# EAGLE design PCB_CoLAB_Schematic_V2 (EAGLE 9.6.2)
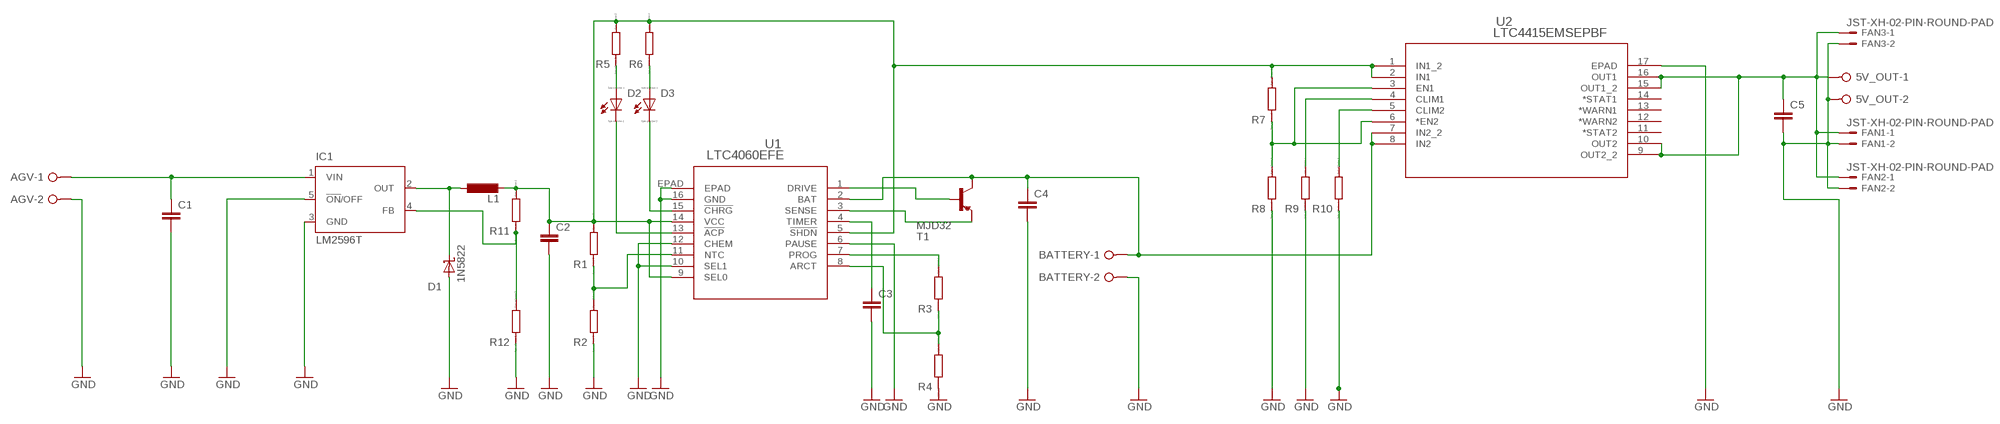
[diagram p0: schematic, sheet 1]

## Parts
5V_OUT  W237-02P  [W237-132]
AGV  W237-02P  [W237-132]
BATTERY  W237-02P  [W237-132]
C1  C-EU050-075X075  [C050-075X075]
C2  C-EU025-050X050  [C025-050X050]
C3  C-EU025-024X044  [C025-024X044]
C4  C-EU050-050X075  [C050-050X075]
C5  C-EU025-024X044  [C025-024X044]
D1  1N5822  [DIOAD2120W130L950D530P]
D2  LED_ELD260  [LED_LD260]
D3  LED_ELD260  [LED_LD260]
FAN1  JST-XH-02-PIN-ROUND-PAD  [JST-XH-02-PACKAGE-ROUND-PAD]
FAN2  JST-XH-02-PIN-ROUND-PAD  [JST-XH-02-PACKAGE-ROUND-PAD]
FAN3  JST-XH-02-PIN-ROUND-PAD  [JST-XH-02-PACKAGE-ROUND-PAD]
IC1  LM2596T  [T05D]
L1  L-EU0204/7  [0204/7]
R1  R0204/7  [0204/7]
R2  R0204/7  [0204/7]
R3  R0204/7  [0204/7]
R4  R0204/7  [0204/7]
R5  R0204/7  [0204/7]
R6  R0204/7  [0204/7]
R7  R0204/7  [0204/7]
R8  R0204/7  [0204/7]
R9  R0204/7  [0204/7]
R10  R0204/7  [0204/7]
R11  R0204/7  [0204/7]
R12  R0204/7  [0204/7]
T1  MJD32  [DPAK]
U1  LTC4060EFE  [TSSOP-16_FE/BC_LIT]
U2  LTC4415EMSEPBF  [MSOP-16_MSE]

## Nets
GND: 5V_OUT.2 AGV.2 BATTERY.2 C1.2 C2.2 C3.2 C4.2 C5.2 D1.A FAN1.2 FAN2.2 FAN3.2 IC1.3(GND) IC1.5(!ON!/OFF) R2.1 R4.1 R8.1 R9.1 R10.1 R12.1 U1.6(PAUSE) U1.10(SEL1) U1.12(CHEM) U1.16(GND) U1.EPAD U2.17(EPAD)
N$1: R3.2 U1.7(PROG)
N$2: AGV.1 C1.1 IC1.1(VIN)
N$3: D1.C IC1.2(OUT) L1.1
N$4: R1.1 R2.2 U1.11(NTC)
N$5: R7.1 R8.2 U2.3(EN1) U2.6(*EN2)
N$6: R3.1 R4.2 U1.8(ARCT)
N$7: T1.3(E) U1.3(SENSE)
N$8: T1.1(B) U1.1(DRIVE)
N$10: C2.1 L1.2 R1.2 R5.2 R6.2 R7.2 R11.2 U1.5(!SHDN) U1.9(SEL0) U1.14(VCC) U2.1(IN1_2) U2.2(IN1)
N$11: C3.1 U1.4(TIMER)
N$12: D2.A R5.1
N$13: D2.K(C) U1.13(!ACP)
N$14: D3.K(C) U1.15(!CHRG)
N$15: D3.A R6.1
N$16: BATTERY.1 C4.1 T1.4(C) U1.2(BAT) U2.7(IN2_2) U2.8(IN2)
N$17: R9.2 U2.4(CLIM1)
N$18: R10.2 U2.5(CLIM2)
N$19: 5V_OUT.1 C5.1 FAN1.1 FAN2.1 FAN3.1 U2.9(OUT2_2) U2.10(OUT2) U2.15(OUT1_2) U2.16(OUT1)
N$20: IC1.4(FB) R11.1 R12.2
Unconnected: U2.11(*STAT2) U2.12(*WARN2) U2.13(*WARN1) U2.14(*STAT1)

## Library data of the parts
5V_OUT AGV BATTERY = con-wago-508:W237-02P: WAGO SREW CLAMP; OC_FARNELL: unknown; OC_NEWARK: unknown
C1-C5 = rcl:C-EU: CAPACITOR, European symbol
D1 = 1N5822:1N5822: 1N5822 Series 40 V 3 A Through Hole Schottky Rectifier - DO-201AD Check prices <https://pricing.snapeda.com/parts/1N5822/ON%20Semiconductor/view-part?ref=eda>; AVAILABILITY: Good; DESCRIPTION: Diode Schottky 40V 3A Through Hole DO-201AD; MF: ON Semiconductor; MP: 1N5822; PACKAGE: AXIAL LEAD-2 ON Semiconductor; PRICE: None; PURCHASE-URL: https://pricing.snapeda.com/search/part/1N5822/?ref=eda
D2 D3 = eagle-ltspice:LED_E: LED Source: http://www.osram.convergy.de Source: www.luxeon.com Source: www.kingbright.com; SPICEMODEL: NONE; SPICEPREFIX: D; SPICETYPE: diode
FAN1-FAN3 = Rembrandt Electronics - JST XH Connectors v1-0:JST-XH-02-PIN: JST XH Connector 2 Pin Wire to board connector. Pitch: 2,54 mm, (0.100") Number of pins: 2 Created by Rembrandt Electronics www.rembrandtelectronics.com
IC1 = national-semiconductor:LM2596: SIMPLE SWITCHER® Power Converter 150 kHz 3A Step-Down Voltage Regulator Source: http://www.national.com/ds/LM/LM2596.pdf; MPN: LM2596T-ADJ/LF02; OC_FARNELL: 9494162; OC_NEWARK: 65K5910
L1 = rcl:L-EU: INDUCTOR, European symbol
R1-R12 = eagle-ltspice:R: RESISTOR, European symbol; SPICEMODEL: NONE; SPICEPREFIX: R
T1 = transistor:MJD32*: Complementary Power Transistors
U1 = LTC4060:LTC4060EFE; BUILT_BY: EMA_UL_Team; MANUFACTURER_PART_NUMBER: LTC4060EFE; SOURCELIBRARY: LinearTech_2016-05-13_9; VENDOR: Linear Technology
U2 = LTC4415EMSEPBF:LTC4415EMSEPBF: Check prices <https://pricing.snapeda.com/parts/LTC4415EMSE%23PBF/Analog%20Devices/view-part?ref=eda>; AVAILABILITY: Warning; DESCRIPTION: OR Controller Source Selector Switch P-Channel 2:2 16-MSOP-EP; MF: Analog Devices; MP: LTC4415EMSE#PBF; PACKAGE: MSOP -16 Analog Devices; PRICE: None; PURCHASE-URL: https://pricing.snapeda.com/search/part/LTC4415EMSE#PBF/?ref=eda

## Board
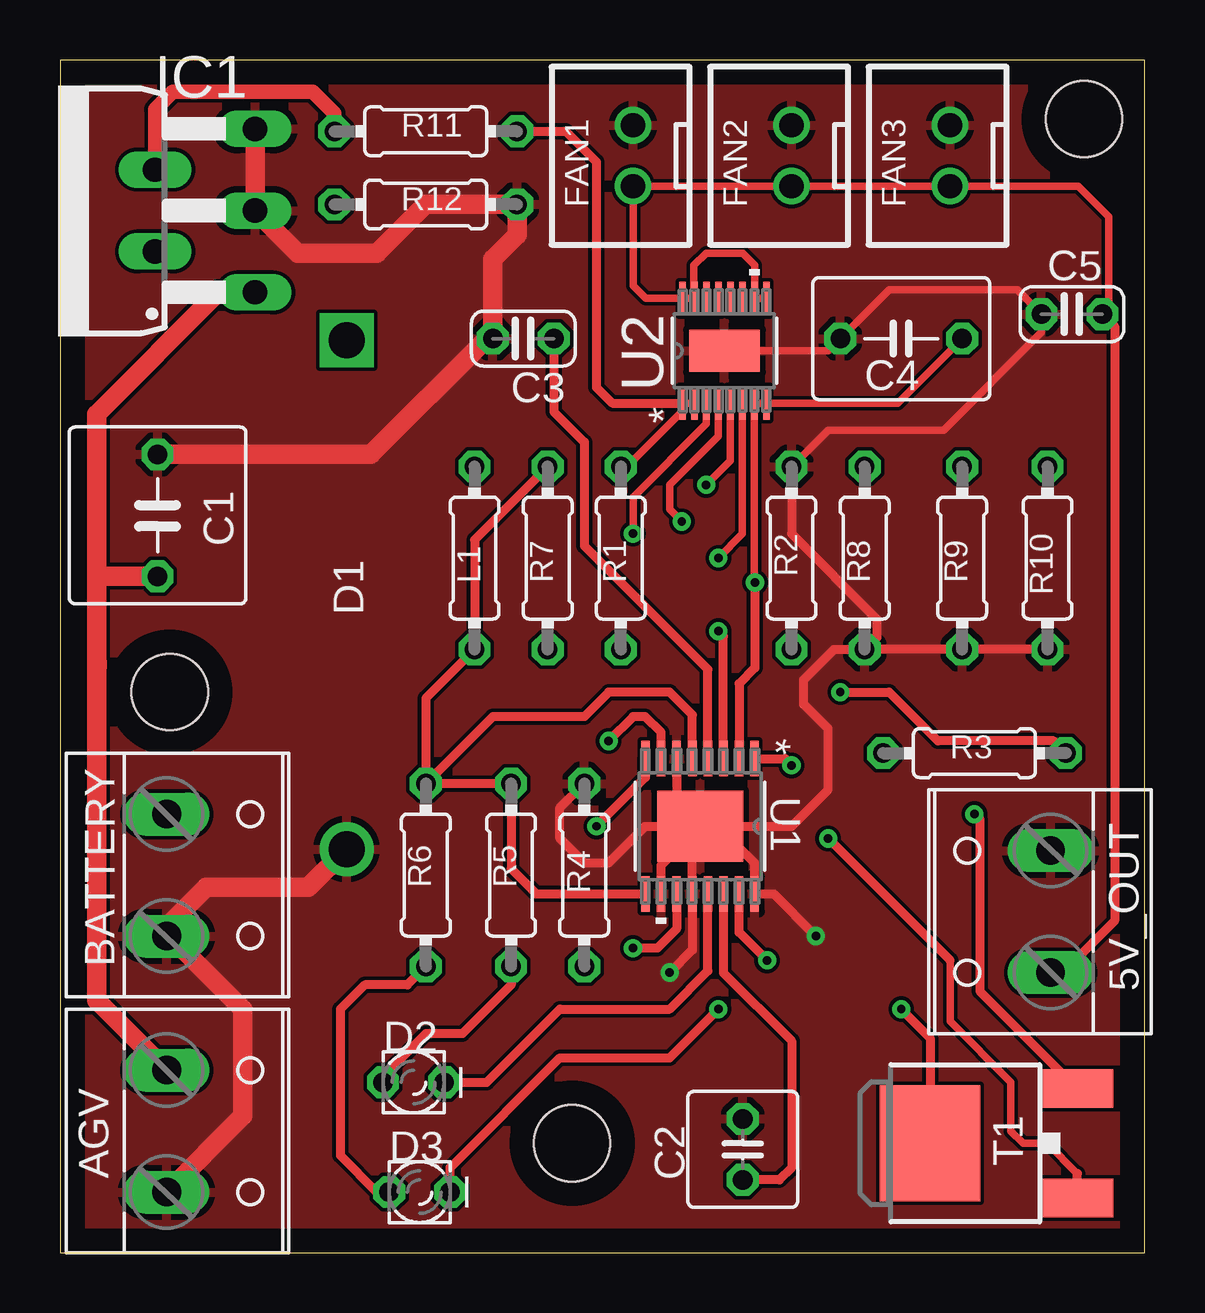
[diagram p1: board, top side]
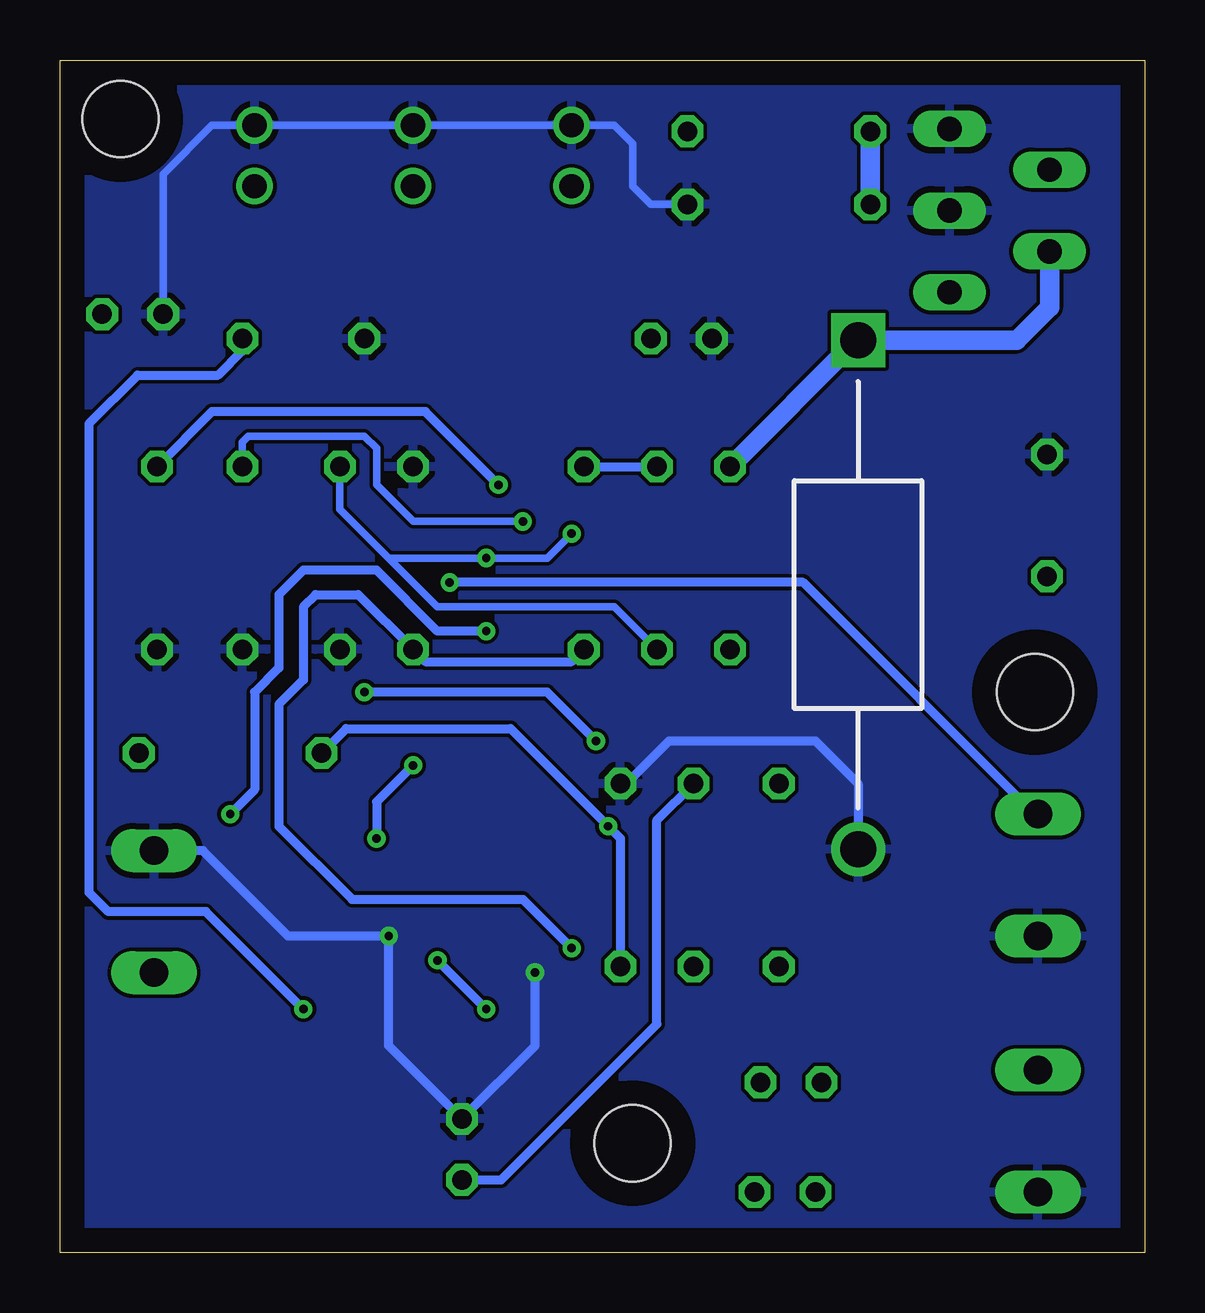
[diagram p2: board, bottom side, seen from below]

Size 45.19 x 49.71 mm. Coordinates in mm from the lower left corner, seen from the top.
Outline: 0,0 45.19,0 45.19,49.71 0,49.71 0,0
Copper layers (1*16): Top 0.035mm / dielectric 1.5mm / Bottom 0.035mm
Design rules "default": minimum track width 6mil, minimum drill 0.35mm, track to track 6mil, track to pad 6mil, pad to pad 6mil, via to via 6mil, smd to smd 6mil, copper to edge 40mil, drill to drill 6mil, minimum pad ring 10mil, minimum via ring 8mil, stop-mask expansion 4mil, vias tented up to drill 0mil, thermal gap 10mil
Holes 3.17 mm at 4.57,23.37 42.67,47.24 21.34,4.57

### Footprints (pad centres in the part's own frame; a part is rotated, then mirrored left to right if it is on the bottom)
W237-132 = drill 1.194 long: 1 -2.54,-0.635; 2 2.54,-0.635
C050-075X075 = drill 0.813 octagon: 1 -2.54,0; 2 2.54,0
C025-050X050 = drill 0.813 octagon: 1 -1.27,0; 2 1.27,0
C025-024X044 = drill 0.813 octagon: 1 -1.27,0; 2 1.27,0
C050-050X075 = drill 0.813 octagon: 1 -2.54,0; 2 2.54,0
DIOAD2120W130L950D530P = drill 1.5 pad 2.25: A 10.6,0 | drill 1.5 pad 2.25 square: C -10.6,0
LED_LD260 = drill 0.813 octagon: A -1.27,0; K 1.27,0
JST-XH-02-PACKAGE-ROUND-PAD = drill 1.016: 1 -1.27,0; 2 1.27,0
T05D = drill 1.016 long: 1 -3.404,-5.08; 2 -1.702,-0.914; 3 0,-5.08; 4 1.702,-0.914; 5 3.404,-5.08
0204/7 = drill 0.813 octagon: 1 -3.81,0; 2 3.81,0
DPAK = smd 1.6 x 3: 1 -2.28,-4.04; 3 2.28,-4.04 | smd 4.826 x 4.191: 4 0,2.096
TSSOP-16_FE/BC_LIT = smd 1.473 x 0.356: 1 -2.819,2.276; 2 -2.819,1.626; 3 -2.819,0.975; 4 -2.819,0.325; 5 -2.819,-0.325; 6 -2.819,-0.975; 7 -2.819,-1.626; 8 -2.819,-2.276; 9 2.819,-2.276; 10 2.819,-1.626; 11 2.819,-0.975; 12 2.819,-0.325; 13 2.819,0.325; 14 2.819,0.975; 15 2.819,1.626; 16 2.819,2.276 | smd 2.946 x 3.581: EPAD 0,0
MSOP-16_MSE = smd 1.397 x 0.279: 1 -2.184,1.751; 2 -2.184,1.251; 3 -2.184,0.751; 4 -2.184,0.25; 5 -2.184,-0.25; 6 -2.184,-0.751; 7 -2.184,-1.251; 8 -2.184,-1.751; 9 2.184,-1.751; 10 2.184,-1.251; 11 2.184,-0.751; 12 2.184,-0.25; 13 2.184,0.25; 14 2.184,0.751; 15 2.184,1.251; 16 2.184,1.751 | smd 1.753 x 2.946: 17 0,0

### Placement (x,y rotation side)
5V_OUT  40.64,14.22 90 top
AGV  5.08,5.08 270 top
BATTERY  5.08,15.75 270 top
C1  4.06,30.73 90 top
C2  28.45,4.32 90 top
C3  19.3,38.1 180 top
C4  35.05,38.1 180 top
C5  42.16,39.12 180 top
D1  11.94,27.43 270 bottom
D2  14.73,7.11 0 top
D3  14.99,2.54 0 top
FAN1  23.88,45.72 90 top
FAN2  30.48,45.72 90 top
FAN3  37.08,45.72 90 top
IC1  3.05,43.43 90 top
L1  17.27,28.96 270 top
R1  23.37,28.96 90 top
R2  30.48,28.96 270 top
R3  38.1,20.83 0 top
R4  21.84,15.75 270 top
R5  18.8,15.75 90 top
R6  15.24,15.75 90 top
R7  20.32,28.96 90 top
R8  33.53,28.96 90 top
R9  37.59,28.96 90 top
R10  41.15,28.96 90 top
R11  15.24,46.74 0 top
R12  15.24,43.69 180 top
T1  38.35,4.57 90 top
U1  26.67,17.78 270 top
U2  27.69,37.59 90 top

### Tracks (layer width: path | path; a pad name or v marks a point on that pad's centre or on a via)
GND  (via drill 0.35)
  Top 0.305: R2.1 32,34.29 36.83,34.29 40.89,38.35 C5.2 39.88,40.13 34.54,40.13 C4.2 32,37.59 U2.17
  Top 0.381: v25.4,11.68 26.34,12.63 U1.12 26.34,17.45 U1.EPAD | v31.5,13.21 29.74,14.96 U1.16 28.95,16.25 27.41,17.78 U1.EPAD | R8.1 32.26,25.15 30.99,23.88 30.99,22.86 32,21.84 32,19.3 30.48,17.78 U1.EPAD | R10.1 R9.1 R8.1 | R2.1 30.48,29.97 34.04,26.42 34.04,25.65 R8.1 | U1.EPAD 26.16,17.27 | R4.1 20.83,18.54 20.83,17.27 21.84,16.26 22.86,16.26 24.38,17.78 U1.EPAD | U1.10 25.04,16.15 U1.EPAD | U1.6 25.7,18.76 U1.EPAD
  Top 0.813: IC1.3 8.38,43.69 | IC1.5 IC1.3 | AGV.2 7.62,5.71 7.62,10.16 4.57,13.21 | 4.57,13.21 BATTERY.2 | D1.A 10.35,15.24 6.1,15.24 4.57,13.72 4.57,13.21 | IC1.3 9.91,41.66 13.21,41.66 15.24,43.69 R12.1 19.05,42.42 18.03,41.4 C3.2 17.78,38.1 12.95,33.27 C1.2
  Bottom 0.305: C5.2 40.89,44.96 38.86,46.99 FAN3.2 FAN2.2 FAN1.2 22.1,46.99 21.34,46.23 21.34,44.45 20.57,43.69 R12.1
  Bottom 0.381: R4.1 21.59,19.56 19.81,21.34 13.72,21.34 11.94,19.56 D1.A | v25.4,11.68 25.4,8.64 C2.2 31.5,8.64 v31.5,13.21 35.69,13.21 39.24,16.76 5V_OUT.2
  pour Bottom: -0.51,50.29 46.23,50.29 46.23,-1.02 -0.51,-1.02
  pour Top: -1.02,50.29 45.72,50.29 46.23,50.8 46.23,-0.51 45.72,-1.02 -1.52,-1.02 -1.02,-0.51
N$1  (via drill 0.35)
  Top 0.381: U1.7 25.04,21.69 24.38,22.35 23.88,22.35 v22.86,21.34 | v32.51,23.37 34.54,23.37 36.58,21.34 41.4,21.34 R3.2
  Bottom 0.381: v22.86,21.34 24.89,23.37 v32.51,23.37
N$2
  Top 0.813: 1.56,24.62 1.56,24.42 1.52,24.38 | 1.52,24.38 1.52,10.54 AGV.1 | 1.52,24.38 1.52,28.45 | 1.52,28.45 1.52,34.95 6.6,40.03 IC1.1 | C1.1 1.78,28.19 1.52,28.45
N$3
  Bottom 0.813: IC1.2 3.96,39.4 5.33,38.03 D1.C 12.01,38.03 L1.1
N$4  (via drill 0.35)
  Top 0.381: U1.11 25.7,13.5 24.89,12.7 v23.88,12.7
  Bottom 0.381: v23.88,12.7 25.91,14.73 33.02,14.73 36.07,17.78 36.07,22.86 35.05,23.88 35.05,26.92 34.54,27.43 32.77,27.43 R2.2 29.97,24.64 23.88,24.64 R1.1
N$5  (via drill 0.35)
  Top 0.305: U2.6 28.44,29.96 v27.43,28.96 | U2.3 26.93,34.55 23.88,31.5 v23.88,29.97
  Bottom 0.305: v23.88,29.97 24.89,28.96 v27.43,28.96 31.5,28.96 | R8.2 33.53,30.99 31.5,28.96 | 31.5,28.96 29.46,26.92 22.1,26.92 R7.1
  Bottom 0.381: R8.2 33.27,32.51
N$6  (via drill 0.35)
  Top 0.381: U1.8 24.39,19.82 v22.35,17.78
  Bottom 0.381: R4.2 21.84,17.27 v22.35,17.78 26.42,21.84 33.27,21.84 R3.1
N$7  (via drill 0.35)
  Top 0.381: U1.3 27.64,25.7 v27.43,25.91 | v38.1,18.29 38.33,18.06 38.33,10.92 T1.3
  Bottom 0.381: v27.43,25.91 29.46,25.91 32,28.45 35.05,28.45 36.07,27.43 36.07,24.38 37.08,23.37 37.08,19.3 v38.1,18.29
N$8  (via drill 0.35)
  Top 0.305: 42.39,3.31 41.13,4.57 40.13,4.57 39.62,5.08 39.62,7.11 37.08,9.65 37.08,12.19
  Top 0.381: v30.48,20.32 30.2,20.6 U1.1 | 37.08,12.19 v32,17.27 | T1.1 42.39,3.31
  Bottom 0.381: v30.48,20.32 32,18.8 v32,17.27
N$10
  Top 0.305: R1.2 23.62,32.77 25.91,35.05 25.91,35.41 U2.2 U2.1
  Top 0.381: R6.2 15.24,23.11 L1.2 17.27,29.72 R7.2 | R6.2 R5.2 18.8,16 19.84,14.96 U1.9 | C2.1 29.97,3.05 30.48,3.56 30.48,8.84 27.64,11.67 U1.14 | U1.5 26.34,22.42 25.4,23.37 22.86,23.37 21.84,22.35 18.03,22.35 R6.2 | R11.2 21.08,46.74 22.35,45.47 22.35,36.07 23.01,35.41 25.91,35.41
  Bottom 0.381: C2.1 26.81,3.05 20.32,9.54 20.32,18.03 R5.2 | R1.2 R7.2
N$11
  Top 0.381: U1.4 26.99,24.31 21.84,29.46 21.84,33.78 20.57,35.05 C3.1
N$12
  Top 0.381: R5.1 18.8,11.18 16.76,9.14 15.24,9.14 13.46,7.37 D2.A
N$13
  Top 0.381: U1.13 26.99,11.75 25.4,10.16 20.83,10.16 17.78,7.11 D2.K
N$14  (via drill 0.35)
  Top 0.381: v27.43,10.16 25.4,8.13 20.83,8.13 16.26,3.56 D3.K | v29.46,12.19 28.3,13.36 U1.15
  Bottom 0.381: v27.43,10.16 v29.46,12.19
N$15
  Top 0.381: R6.1 14.48,11.18 12.7,11.18 11.68,10.16 11.68,4.06 13.21,2.54 D3.A
N$16  (via drill 0.35)
  Top 0.305: U2.7 28.94,27.96 v28.96,27.94 | C4.1 34.9,35.41 U2.7 | U2.8 U2.7
  Top 0.381: v28.96,27.94 28.96,24.38 28.3,23.72 U1.2 | v35.05,10.16 36.26,8.95 T1.4
  Bottom 0.381: v28.96,27.94 14.22,27.94 4.57,18.29 BATTERY.1 | v35.05,10.16 39.12,14.22 43.18,14.22 43.99,15.03 43.99,34.54 41.95,36.58 38.61,36.58 37.59,37.59 C4.1
N$17  (via drill 0.35)
  Top 0.305: U2.4 27.44,34.04 25.4,32 25.4,30.99 v25.91,30.48
  Bottom 0.305: R9.2 37.59,33.78 37.34,34.04 32.51,34.04 32,33.53 32,32 30.48,30.48 v25.91,30.48
N$18  (via drill 0.35)
  Top 0.305: U2.5 27.94,33.02 v26.92,32
  Bottom 0.381: R10.2 38.86,35.05 29.97,35.05 v26.92,32
N$19
  Top 0.305: U2.9 U2.10 28.96,39.8 28.96,41.15 28.45,41.66 26.92,41.66 26.42,41.15 26.42,39.8 U2.15 U2.16 24.41,39.78 23.88,40.31 FAN1.1 FAN2.1 FAN3.1 42.42,44.45 43.69,43.18 43.69,39.37 C5.1
  Top 0.381: C5.1 43.94,38.61 43.94,13.84 41.78,11.68 5V_OUT.1
N$20
  Top 0.61: R11.1 11.43,47.5 10.54,48.39 4.7,48.39 3.96,47.65 IC1.4
  Bottom 0.813: R11.1 R12.2

### Text on the board
tNames: U2